# Altium schematic sheet Sheet2.SchDoc
size A4; SheetNumber: 1; SheetTotal: 1
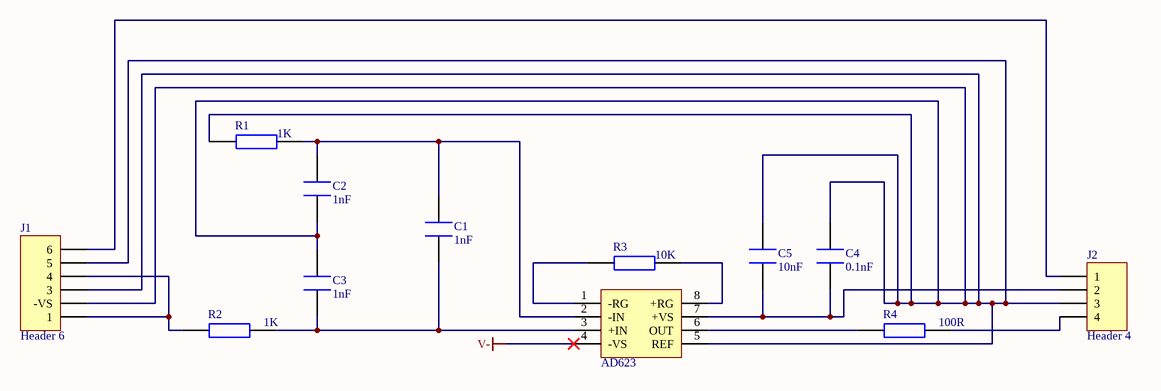
[diagram p0: Sheet2.SchDoc]

## Parts
C1  1nF  [0402]
C2  1nF  [0402]
C3  1nF  [0402]
C4  0.1nF  [0402]
C5  10nF  [0402]
J1  Header 6  [软排线6p]
J2  Header 4  [软排线4p]
R1  1K  [0402-A]
R2  1K  [0402-A]
R3  10K  [0402-A]
R4  100R  [0402-A]
U2  AD623  [SO8_M]

## Nets
V-: U2.4(-VS)
NetC1_1: C1.1 C3.1 R2.2 U2.3(+IN)
NetC1_2: C1.2 C2.2 R1.2 U2.2(-IN)
NetC2_1: C2.1 C3.2 C4.2 C5.2 J1.2(-VS) J1.3 J1.5 J2.3 R1.1 U2.5(REF)
NetC4_1: C4.1 C5.1 J2.2 U2.7(+VS)
NetJ1_1: J1.1 J1.4 R2.1
NetJ1_6: J1.6 J2.1
NetJ2_4: J2.4 R4.2
NetR3_1: R3.1 U2.1(-RG)
NetR3_2: R3.2 U2.8(+RG)
NetR4_1: R4.1 U2.6(OUT)

## Library data of the parts
C1-C5 = CAP: 电容
J1 = Header 6: Header, 6-Pin; LatestRevisionDate: 17-Jul-2002; LatestRevisionNote: Re-released for DXP Platform.; Publisher: Altium Limited
J2 = Header 4: Header, 4-Pin; LatestRevisionDate: 17-Jul-2002; LatestRevisionNote: Re-released for DXP Platform.; Publisher: Altium Limited
R1-R4 = RES: 电阻
U2 = AD623: IC